# Altium project BW1097_R2M2E3.PrjPcb (part 6 of 10)
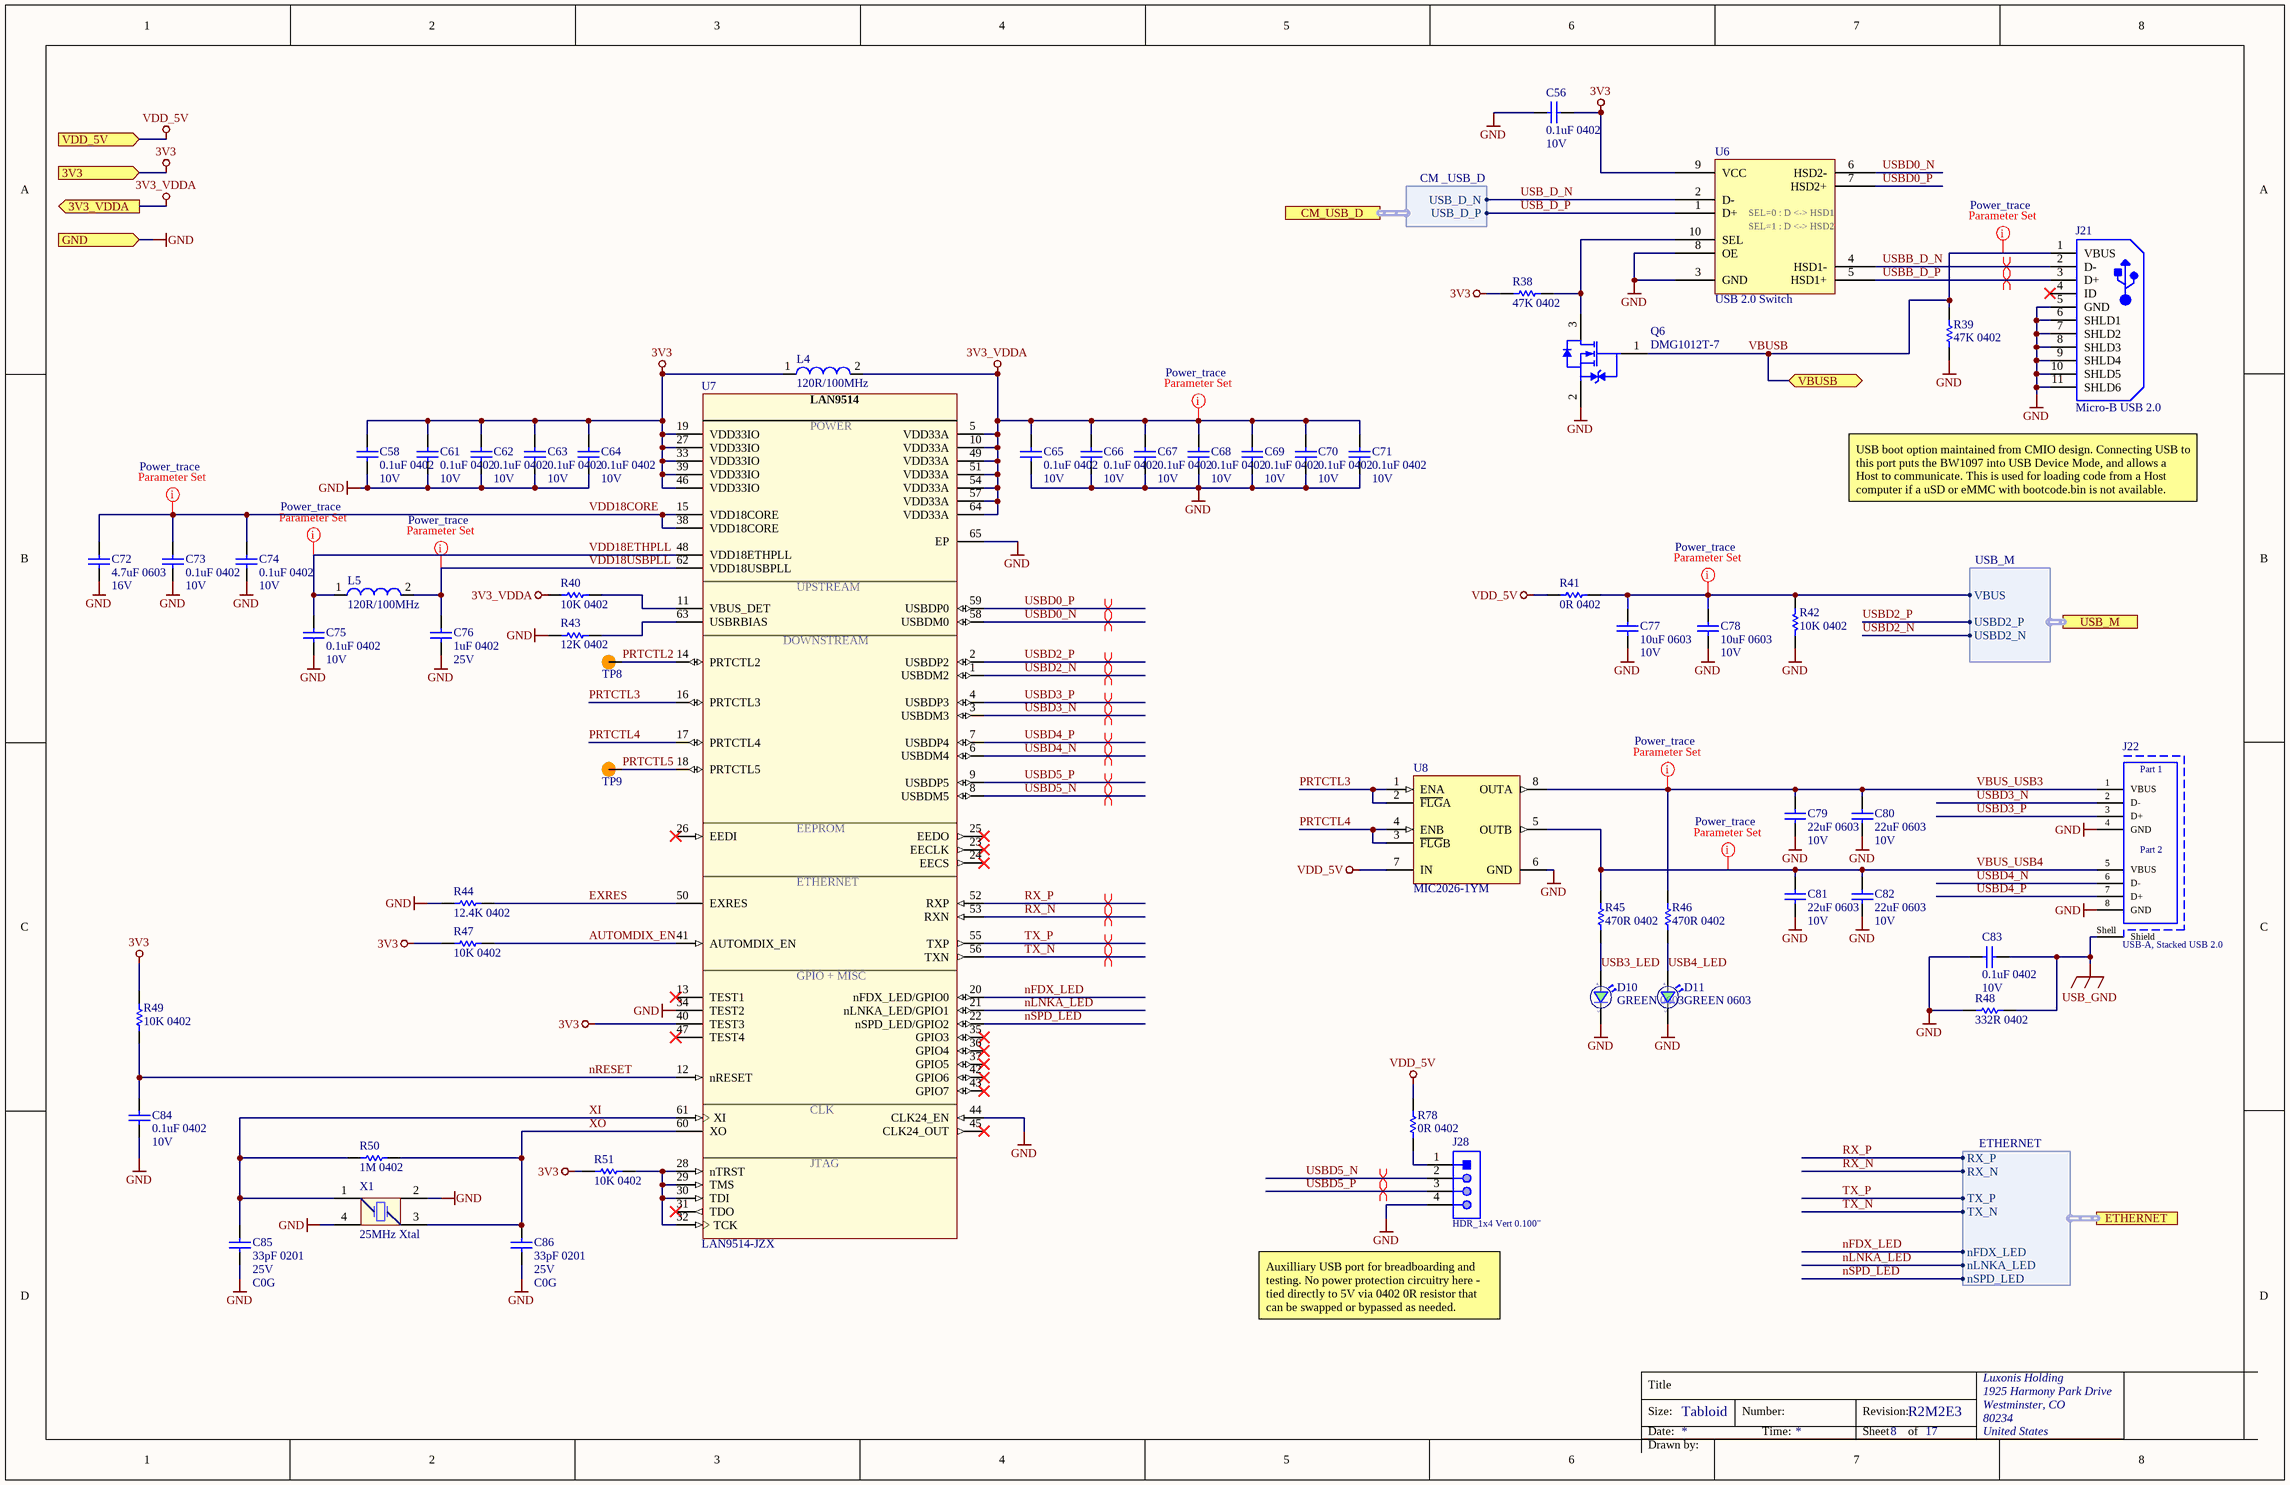
[diagram p114: BW1097_HUB.SchDoc]

## Sheet BW1097_HUB.SchDoc: =project_title (continued)

### Library data of the parts (continued)
X1 = 8Z-25.000MAAJ-T: CRYSTAL 25.0000MHZ 18PF SMD; Manufacturer 1: TXC; Frequency Tolerance: 30ppm; ESR (Equivalent Series Resistance): 100R; Manufacturer Part Number 1: 8Z-25.000MAAJ-T; Supplier 1: Digi-Key; Stock 1: 7343; Pricing 1: 1=1.36000, 10=1.30100, 50=1.27060, 100=1.08900, 500=1.05876, 1000=0.89238 (USD); RoHS: Yes; Mount: Surface Mount; Case/Package: SMD/SMT; Number of Pins: 4; Min Operating Temperature: -10°C; Max Operating Temperature: 70°C; Frequency: 25MHz; Load Capacitance: 18pF; Packaging: Tape and Reel; Package Quantity: 3000; Tolerance: 30ppm; Frequency Stability: 30ppm; Termination: SMD/SMT; Length: 2.5mm; Height: 0.022inch; Width: 2mm; Depth: 2.05mm; REACH SVHC: No SVHC; Lead Free: Lead Free; ComponentLink1URL: https://datasheet.ciiva.com/26833/getdatasheetpartid-743023-26833236.pdf?src-supplier=Verical; ComponentLink1Description: https://datasheet.ciiva.com/26833/getdatasheetpartid-743023-26833236.pdf?src-supplier=Verical; ComponentLink2URL: https://datasheet.ciiva.com/22698/1041872-22698773.pdf?src-supplier=Element14; ComponentLink2Description: https://datasheet.ciiva.com/22698/1041872-22698773.pdf?src-supplier=Element14; ComponentLink3URL: https://datasheet.ciiva.com/1356/number-crystal-basic-1356678.pdf?src-supplier=Element14; ComponentLink3Description: https://datasheet.ciiva.com/1356/number-crystal-basic-1356678.pdf?src-supplier=Element14; ComponentLink4URL: https://datasheet.ciiva.com/859/8z-859017.pdf?src-supplier=Digi-Key; ComponentLink4Description: https://datasheet.ciiva.com/859/8z-859017.pdf?src-supplier=Digi-Key; ComponentLink5URL: https://datasheet.ciiva.com/859/8z-859018.pdf?src-supplier=Digi-Key; ComponentLink5Description: https://datasheet.ciiva.com/859/8z-859018.pdf?src-supplier=Digi-Key; ComponentLink6URL: https://datasheet.ciiva.com/859/8z-859019.pdf?src-supplier=Digi-Key; ComponentLink6Description: https://datasheet.ciiva.com/859/8z-859019.pdf?src-supplier=Digi-Key; Supplier 2: Mouser; Supplier Part Number 1: 887-1145-1-ND; Supplier Part Number 2: 717-8Z-25.000MAAJ-T

## Sheet BW1097_EthernetSchDoc.SchDoc: =project_title
size Tabloid; CompanyName: Luxonis Holding; DrawnBy: Brian Weinstein; Organization: Luxonis Holding; Address1: 1925 Harmony Park Drive; Address2: Westminster, CO; Address3: 80234; Address4: United States; DocumentNumber: D0000196; Revision: R2M2E3; SheetNumber: 16; SheetTotal: 17
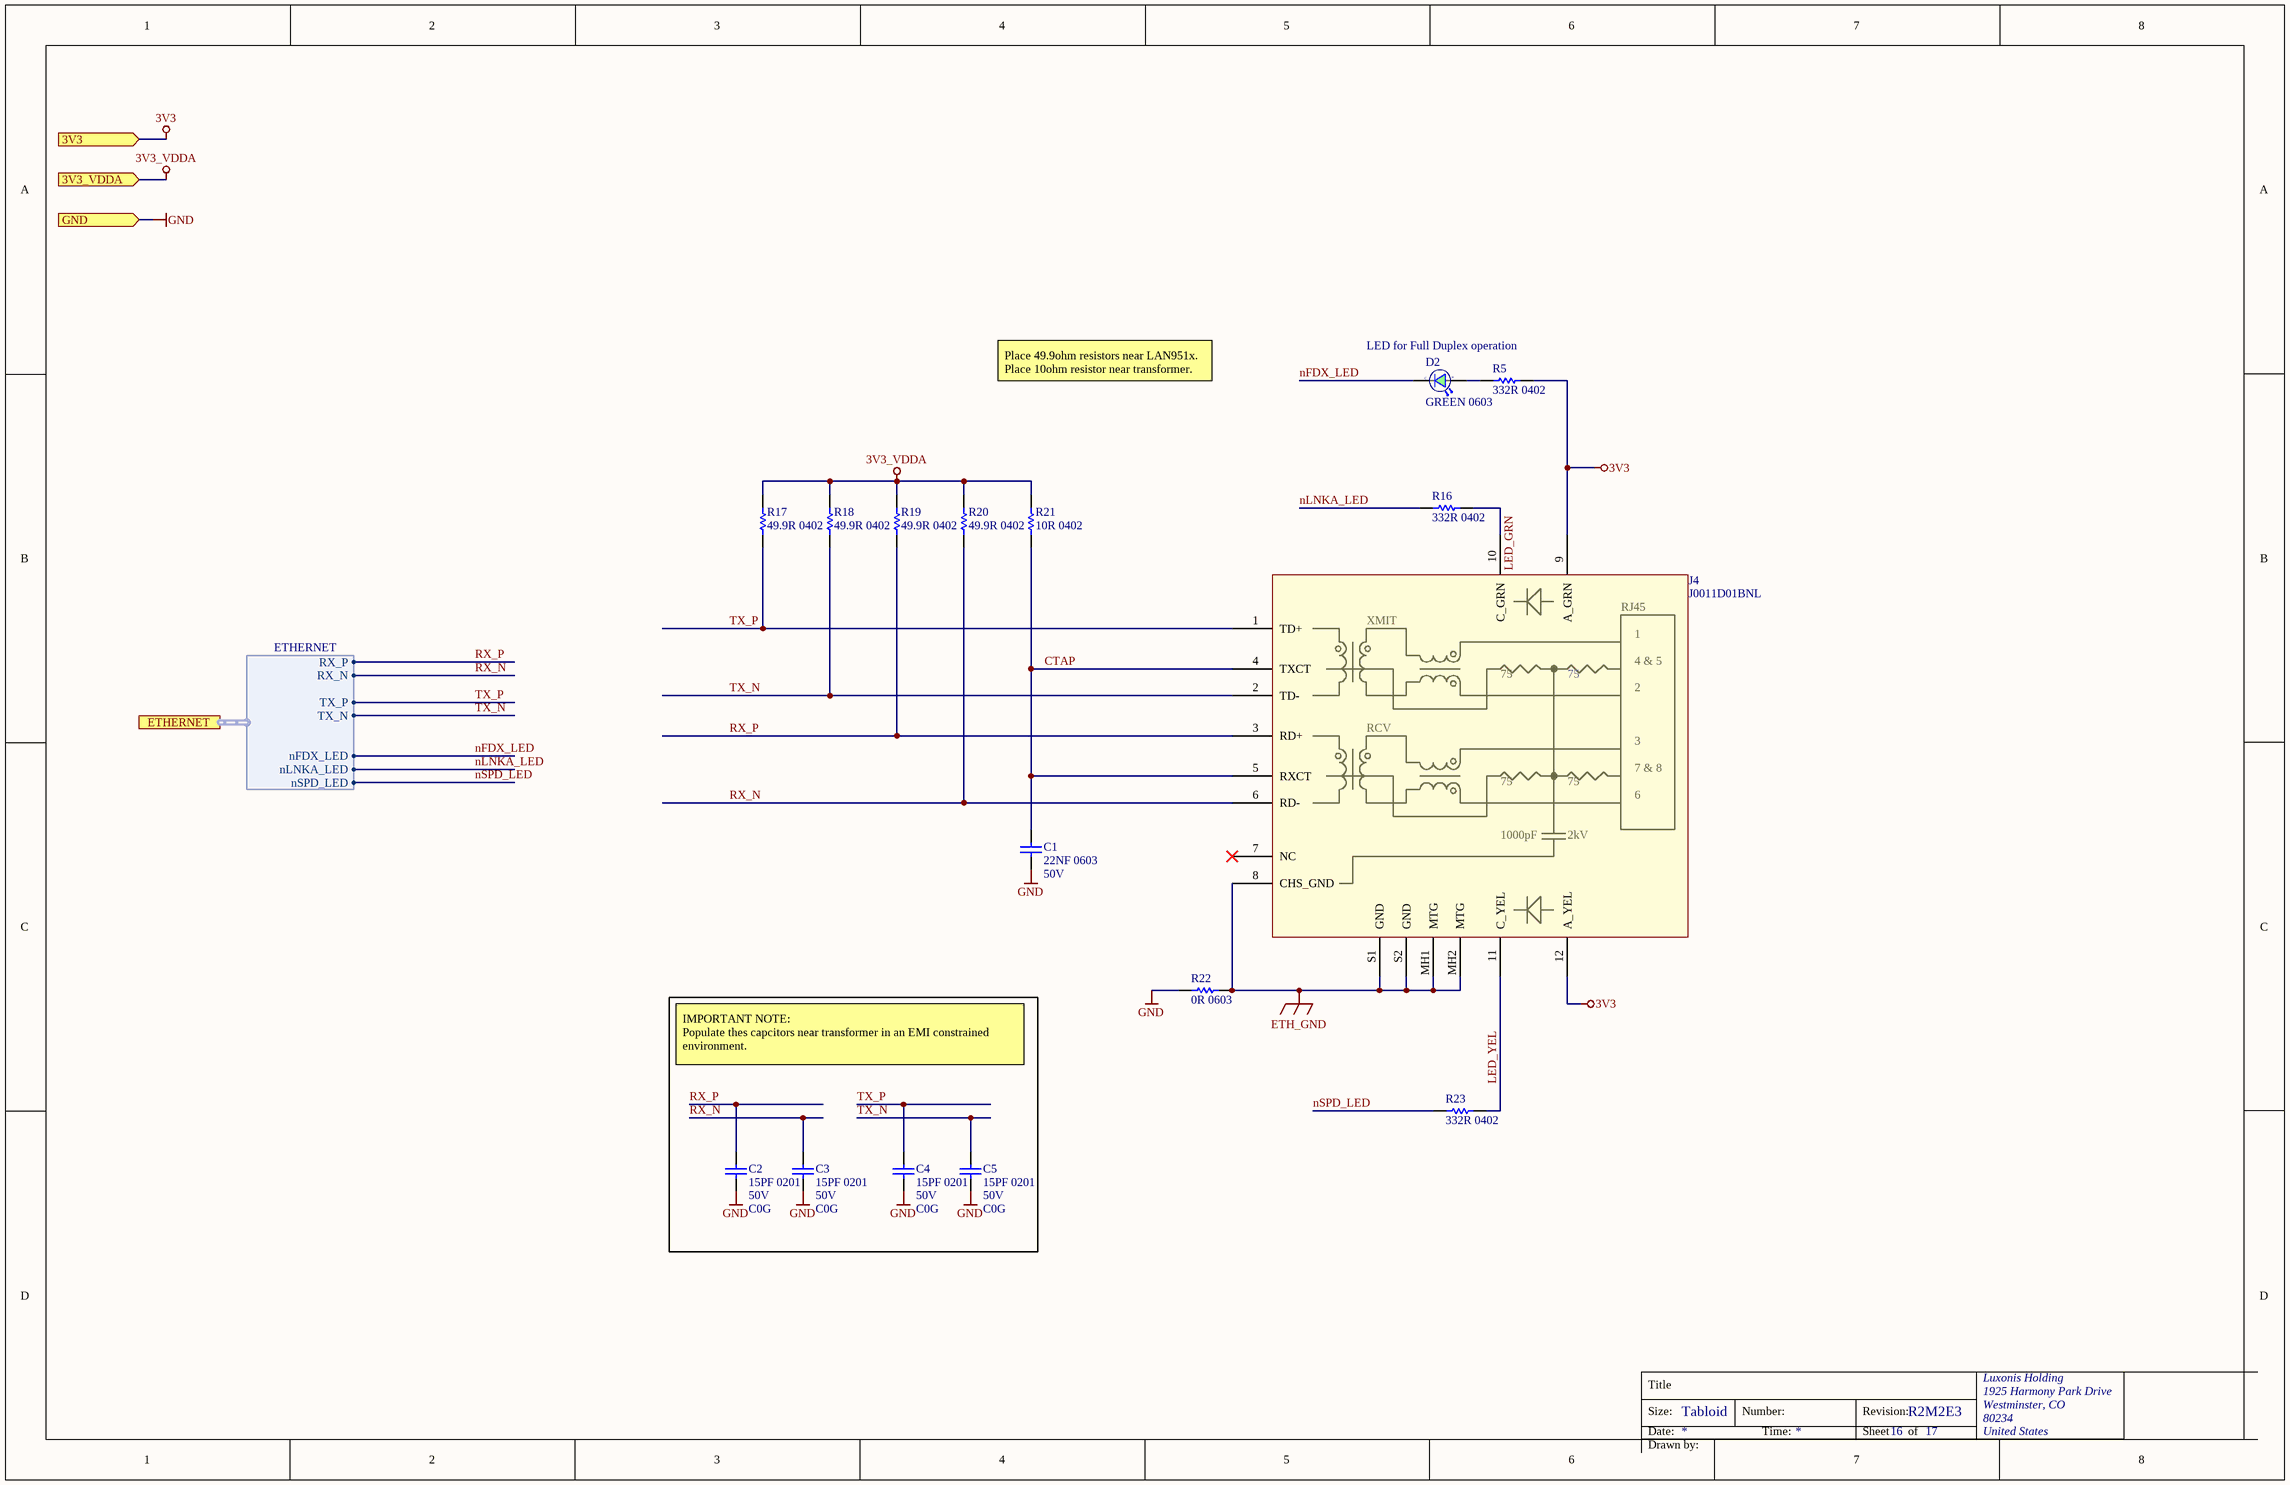
[diagram p7: BW1097_EthernetSchDoc.SchDoc]

### Parts
C1  22NF 0603  Voltage: 50V  [CAPC0603(1608)100_N]
C2  15PF 0201  Voltage: 50V  Dielectric: C0G  [CAPC0201(0603)33_L]
C3  15PF 0201  Voltage: 50V  Dielectric: C0G  [CAPC0201(0603)33_L]
C4  15PF 0201  Voltage: 50V  Dielectric: C0G  [CAPC0201(0603)33_L]
C5  15PF 0201  Voltage: 50V  Dielectric: C0G  [CAPC0201(0603)33_L]
D2  GREEN 0603  [SML_D1xx8W]
J4  J0011D01BNL  [J0011D01BNL]
R5  332R 0402  [RESC0402(1005)_N]
R16  332R 0402  [RESC0402(1005)_N]
R17  49.9R 0402  [RESC0402(1005)_N]
R18  49.9R 0402  [RESC0402(1005)_N]
R19  49.9R 0402  [RESC0402(1005)_N]
R20  49.9R 0402  [RESC0402(1005)_N]
R21  10R 0402  [RESC0402(1005)_N]
R22  0R 0603  [RESC0603(1608)_N]
R23  332R 0402  [RESC0402(1005)_N]

### Ports
3V3 (in), 3V3_VDDA (in), ETHERNET (harness ETHERNET), GND (in)

### Harnesses
ETHERNET: RX_P, RX_N, TX_P, TX_N, nFDX_LED, nLNKA_LED, nSPD_LED

### Nets
3V3: J4.9(A_GRN) J4.12(A_YEL) R5.2 ; port 3V3
3V3_VDDA: R17.2 R18.2 R19.2 R20.2 R21.2 ; port 3V3_VDDA
ETH_GND: J4.8(CHS_GND) J4.MH1(MTG) J4.MH2(MTG) J4.S1(GND) J4.S2(GND) R22.2
GND: C1.1 C2.1 C3.1 C4.1 C5.1 R22.1 ; port GND
CTAP: C1.2 J4.4(TXCT) J4.5(RXCT) R21.1
LED_GRN: J4.10(C_GRN) R16.2
LED_YEL: J4.11(C_YEL) R23.2
nFDX_LED: D2.1(C) ; port ETHERNET.nFDX_LED
nLNKA_LED: R16.1 ; port ETHERNET.nLNKA_LED
nSPD_LED: R23.1 ; port ETHERNET.nSPD_LED
RX_N: C3.2 J4.6(RD-) R20.1 ; port ETHERNET.RX_N
RX_P: C2.2 J4.3(RD+) R19.1 ; port ETHERNET.RX_P
TX_N: C5.2 J4.2(TD-) R18.1 ; port ETHERNET.TX_N
TX_P: C4.2 J4.1(TD+) R17.1 ; port ETHERNET.TX_P
NetD2_2: D2.2(A) R5.1

Not connected (* = marked no-connect by the designer): J4 7(NC)*

### Notes on the sheet
- LED for Full Duplex operation
- Place 49.9ohm resistors near LAN951x.
  Place 10ohm resistor near transformer.
- IMPORTANT NOTE:
  Populate thes capcitors near transformer in an EMI constrained environment.
- Title
- Size:
- Date:
- Tabloid
- Number:
- Time:
- Revision:
- Sheet
- of
- Drawn by:
- (in symbol J0011D01BNL) XMIT; 4 & 5; 75; RCV; 7 & 8; 1000pF; 2kV

### Library data of the parts
C1 = C0603C223K5RACTU: CAP CER 0.022UF 50V X7R 0603; Manufacturer 1: KEMET; Dielectric Material: Ceramic; Tolerance: 10%; Dissipation Factor: 2.5%; Manufacturer Part Number 1: C0603C223K5RACTU; Supplier 1: Digi-Key; Stock 1: 77845; Pricing 1: 1=0.10000, 10=0.06400, 100=0.02850, 500=0.02036, 1000=0.01600 (USD); RoHS: Yes; Mount: Surface Mount,PCB; Case/Package: 0603; Number of Pins: 2; Case Code (Imperial): 0603; Case Code (Metric): 1608; Contact Plating: Tin,Matte; Min Operating Temperature: -55°C; Max Operating Temperature: 125°C; Capacitance: 22nF; Packaging: Tape and Reel; Voltage Rating (DC): 50V; Dielectric: X7R; Package Quantity: 4000; Termination: SMD/SMT; Voltage Rating: 50V; Length: 1.6mm; Height: 0.8mm; Depth: 0.8mm; Width: 0.8mm; Thickness: 0.034inch; Lead Pitch: 0.7mm; Radiation Hardening: No; REACH SVHC: No SVHC; ComponentLink1URL: https://datasheet.ciiva.com/7823/1776091-7823698.pdf?src-supplier=Element14; ComponentLink1Description: https://datasheet.ciiva.com/7823/1776091-7823698.pdf?src-supplier=Element14; ComponentLink2URL: https://datasheet.ciiva.com/7824/kem-c1002-x7r-smd-7824021.pdf?src-supplier=Element14; ComponentLink2Description: https://datasheet.ciiva.com/7824/kem-c1002-x7r-smd-7824021.pdf?src-supplier=Element14; Supplier 2: Mouser; Supplier Part Number 1: 399-1280-6-ND; Supplier Part Number 2: 80-C0603C223K5R
C2-C5 = GRM0335C1H150JA01D: CAP CER 15PF 50V C0G/NP0 0201; Manufacturer 1: Murata; Tolerance: 5%; Manufacturer Part Number 1: GRM0335C1H150JA01D; Supplier 1: Digi-Key; Stock 1: 667552; Pricing 1: 1=0.10000, 10=0.01500, 100=0.00680, 500=0.00484, 1000=0.00380, 2500=0.00345, 5000=0.00317 (USD); RoHS: Yes; Mount: Surface Mount; Case/Package: 0201; Case Code (Metric): 0603; Case Code (Imperial): 0201; Min Operating Temperature: -55°C; Max Operating Temperature: 125°C; Capacitance: 15pF; Packaging: Tape and Reel; Voltage Rating: 50V; Voltage Rating (DC): 50V; Package Quantity: 1; Termination: SMD/SMT; Length: 0.6mm; Height: 0.3mm; Width: 0.012inch; Thickness: 0.013inch; Depth: 0.3mm; Radiation Hardening: No; Lead Free: Lead Free; REACH SVHC: No SVHC; ComponentLink1URL: https://datasheet.ciiva.com/11608/product-11608680.pdf?src-supplier=Avnet; ComponentLink1Description: https://datasheet.ciiva.com/11608/product-11608680.pdf?src-supplier=Avnet; ComponentLink2URL: https://datasheet.ciiva.com/26843/getdatasheetpartid-707838-26843722.pdf?src-supplier=Verical; ComponentLink2Description: https://datasheet.ciiva.com/26843/getdatasheetpartid-707838-26843722.pdf?src-supplier=Verical; ComponentLink3URL: https://datasheet.ciiva.com/14906/partnumbering-e-01-14906504.pdf?src-supplier=Digi-Key; ComponentLink3Description: https://datasheet.ciiva.com/14906/partnumbering-e-01-14906504.pdf?src-supplier=Digi-Key; ComponentLink4URL: https://datasheet.ciiva.com/5445/product-5445691.pdf?src-supplier=Mouser; ComponentLink4Description: https://datasheet.ciiva.com/5445/product-5445691.pdf?src-supplier=Mouser; Supplier 2: Mouser; Supplier Part Number 1: 490-6116-1-ND; Supplier Part Number 2: 81-GRM0335C1H150JA1D
D2 = SML-D12M8WT86: as D10 on sheet BW1097_HUB; Supplier 1: Digi-Key; Manufacturer Part Number: SML-D12M8WT86; Stock 1: 112971; Pricing 1: 1=0.33000, 10=0.23900, 100=0.11340, 500=0.07560, 1000=0.05922 (USD); Mount: Surface Mount; Case/Package: 0603; Number of Pins: 2; Case Code (Metric): 1608; Case Code (Imperial): 0603; Min Operating Temperature: -40°C; Max Operating Temperature: 85°C; Forward Voltage: 2.2V; Packaging: Tape and Reel; Dominant Wavelength: 572nm; Wavelength: 572nm; Illumination Colour: Green; Package Quantity: 1; Test Current: 20mA; Lens Transparency: Diffused; Length: 1.6mm; Height: 0.65mm; Width: 0.8mm; Radiation Hardening: No; REACH SVHC: Unknown; Lead Free: Lead Free; ComponentLink1URL: https://datasheet.ciiva.com/11774/0900766b80df3ada-11774260.pdf; ComponentLink1Description: https://datasheet.ciiva.com/11774/0900766b80df3ada-11774260.pdf; ComponentLink2URL: https://datasheet.ciiva.com/3161/sml-d1-3161419.pdf; ComponentLink2Description: https://datasheet.ciiva.com/3161/sml-d1-3161419.pdf; ComponentLink3URL: https://datasheet.ciiva.com/2110/sml-d1-2110396.pdf; ComponentLink3Description: https://datasheet.ciiva.com/2110/sml-d1-2110396.pdf; ComponentLink4URL: https://datasheet.ciiva.com/2110/sml-d1-2110397.pdf; ComponentLink4Description: https://datasheet.ciiva.com/2110/sml-d1-2110397.pdf; ComponentLink5URL: https://datasheet.ciiva.com/2110/sml-d1-2110398.pdf; ComponentLink5Description: https://datasheet.ciiva.com/2110/sml-d1-2110398.pdf; Manufacturer 1: Rohm; Manufacturer Part Number 1: SML-D12M8WT86; RoHS: Yes; Color: Green,Yellow; Illumination Color: Green; ComponentLink6URL: https://datasheet.ciiva.com/11774/0900766b80df3ada-11774260.pdf?src-supplier=RSComponents; ComponentLink6Description: https://datasheet.ciiva.com/11774/0900766b80df3ada-11774260.pdf?src-supplier=RSComponents; ComponentLink7URL: https://datasheet.ciiva.com/3161/sml-d1-3161419.pdf?src-supplier=Avnet; ComponentLink7Description: https://datasheet.ciiva.com/3161/sml-d1-3161419.pdf?src-supplier=Avnet; ComponentLink8URL: https://datasheet.ciiva.com/2110/sml-d1-2110396.pdf?src-supplier=Digi-Key; ComponentLink8Description: https://datasheet.ciiva.com/2110/sml-d1-2110396.pdf?src-supplier=Digi-Key; ComponentLink9URL: https://datasheet.ciiva.com/2110/sml-d1-2110397.pdf?src-supplier=Digi-Key; ComponentLink9Description: https://datasheet.ciiva.com/2110/sml-d1-2110397.pdf?src-supplier=Digi-Key; ComponentLink10URL: https://datasheet.ciiva.com/2110/sml-d1-2110398.pdf?src-supplier=Digi-Key; ComponentLink10Description: https://datasheet.ciiva.com/2110/sml-d1-2110398.pdf?src-supplier=Digi-Key; Supplier Part Number 1: 511-1578-1-ND
J4 = J0011D01BNL: CONN MAGJACK 1PORT 100 BASE-TX 1 Port RJ45 Magjack Connector Through Hole 10/100 Base-TX, AutoMDIX; Manufacturer 1: Pulse; Number of Contacts: 8; Shielding: Shielded; Gender: Female; Current Rating: 8mA; Number of Ports: 1; Direction: Down; Number of Cores per Jack: 4; Pitch: 2.54mm; Manufacturer Part Number 1: J0011D01BNL; Supplier 1: Digi-Key; Stock 1: 2382; Pricing 1: 1=7.92000, 10=7.59000, 25=6.93000, 50=6.60000, 100=6.27000, 250=5.61000, 500=5.28000, 1000=4.62000 (USD); RoHS: Yes; Mount: Through Hole; Contact Plating: Gold; Contact Material: Bronze; Color: Green,Yellow; Housing Material: Thermoplastic; Min Operating Temperature: 0°C; Max Operating Temperature: 70°C; Termination: Solder; Orientation: Right Angle; Package Quantity: 30; Number of Rows: 1; Packaging: Tray; Connector Type: RJ45; Number of Positions Loaded: 8; Length: 16.26mm; Depth: 21.59mm; Radiation Hardening: No; Lead Free: Lead Free; ComponentLink1URL: https://datasheet.ciiva.com/3138/+j403-3138718.pdf?src-supplier=Avnet; ComponentLink1Description: https://datasheet.ciiva.com/3138/+j403-3138718.pdf?src-supplier=Avnet; ComponentLink2URL: https://datasheet.ciiva.com/16650/+j403-16650550.pdf?src-supplier=Avnet+Europe; ComponentLink2Description: https://datasheet.ciiva.com/16650/+j403-16650550.pdf?src-supplier=Avnet+Europe; Supplier Part Number 1: 553-1483-ND; Supplier 2: Arrow; Supplier 3: Mouser; Supplier 4: TTI; Supplier Part Number 2: J0011D01BNL; Supplier Part Number 3: 673-J0011D01BNL; Supplier Part Number 4: J0011D01BNL
R5 R16 R23 = RC0402FR-07332RL: as R48 on sheet BW1097_HUB; Manufacturer Part Number 1: RC0402FR-07332RL; Supplier 1: Digi-Key; Stock 1: 2789251; Pricing 1: 1=0.10000, 10=0.01600, 100=0.00640, 1000=0.00289, 2500=0.00251, 5000=0.00207 (USD); RoHS: Yes; Case/Package: 0402; Weight: 2.3E-05oz; Case Code (Imperial): 0402; Case Code (Metric): 1005; Min Operating Temperature: -55°C; Max Operating Temperature: 155°C; Packaging: Tape and Reel; Resistance: 332R; Tolerance: 1%; Composition: Thick Film; Voltage Rating (DC): 50V; Termination: SMD/SMT; Military Standard: Not; Length: 1mm; Height: 0.35mm; Width: 0.5mm; Depth: 0.5mm; Lead Free: Lead Free; ComponentLink1URL: https://datasheet.ciiva.com/16929/pyu-rc0402-51-rohs-l-6-r-16929351.pdf?src-supplier=Future+Electronics; ComponentLink1Description: https://datasheet.ciiva.com/16929/pyu-rc0402-51-rohs-l-6-r-16929351.pdf?src-supplier=Future+Electronics; Supplier 2: Mouser; Supplier Part Number 1: 311-332LRCT-ND; Supplier Part Number 2: 603-RC0402FR-07332RL
R17-R20 = RC0402FR-0749R9L: RES SMD 49.9 OHM 1% 1/16W 0402; Manufacturer 1: Yageo; Power Rating: 62.5mW; Temperature Coefficient: 100ppm/°C; Voltage Rating: 50V; Max Power Dissipation: 63mW; Manufacturer Part Number 1: RC0402FR-0749R9L; Supplier 1: Digi-Key; Stock 1: 15110719; Pricing 1: 1=0.10000, 10=0.01600, 100=0.00640, 1000=0.00289, 2500=0.00251, 5000=0.00207 (USD); RoHS: Yes; Case/Package: 0402; Number of Pins: 2; Case Code (Imperial): 0402; Case Code (Metric): 1005; Min Operating Temperature: -55°C; Max Operating Temperature: 155°C; Packaging: Tape and Reel; Resistance: 49.9R; Tolerance: 1%; Composition: Thick Film; Number of Terminations: 2; Package Quantity: 1; Termination: SMD/SMT; Military Standard: Not; Voltage Rating (DC): 50V; Features: Moisture Resistant; Working Voltage: 50V; Length: 1mm; Height: 0.016inch; Width: 0.5mm; Depth: 0.5mm; Lead Free: Lead Free; REACH SVHC: No SVHC; ComponentLink1URL: https://datasheet.ciiva.com/11819/0900766b80c66297-11819508.pdf?src-supplier=RSComponents; ComponentLink1Description: https://datasheet.ciiva.com/11819/0900766b80c66297-11819508.pdf?src-supplier=RSComponents; ComponentLink2URL: https://datasheet.ciiva.com/7983/1018594-7983542.pdf?src-supplier=Element14; ComponentLink2Description: https://datasheet.ciiva.com/7983/1018594-7983542.pdf?src-supplier=Element14; ComponentLink3URL: https://datasheet.ciiva.com/16743/pyu-rc0402-51-rohs-l-6-r-16743942.pdf?src-supplier=Future+Electronics; ComponentLink3Description: https://datasheet.ciiva.com/16743/pyu-rc0402-51-rohs-l-6-r-16743942.pdf?src-supplier=Future+Electronics; ComponentLink4URL: https://datasheet.ciiva.com/22747/1018594-22747514.pdf?src-supplier=Element14; ComponentLink4Description: https://datasheet.ciiva.com/22747/1018594-22747514.pdf?src-supplier=Element14; ComponentLink5URL: https://datasheet.ciiva.com/2453/pyu-r-int-thick-7-2453355.pdf?src-supplier=Digi-Key; ComponentLink5Description: https://datasheet.ciiva.com/2453/pyu-r-int-thick-7-2453355.pdf?src-supplier=Digi-Key; ComponentLink6URL: https://datasheet.ciiva.com/2453/pyu-r-int-thick-7-2453356.pdf?src-supplier=Digi-Key; ComponentLink6Description: https://datasheet.ciiva.com/2453/pyu-r-int-thick-7-2453356.pdf?src-supplier=Digi-Key; ComponentLink7URL: https://datasheet.ciiva.com/2453/pyu-r-int-thick-7-2453357.pdf?src-supplier=Digi-Key; ComponentLink7Description: https://datasheet.ciiva.com/2453/pyu-r-int-thick-7-2453357.pdf?src-supplier=Digi-Key; Supplier 2: Mouser; Supplier Part Number 1: 311-49.9LRCT-ND; Supplier Part Number 2: 603-RC0402FR-0749R9L
R21 = RC0402FR-0710RL: RES SMD 10 OHM 1% 1/16W 0402; Manufacturer 1: Yageo; Power Rating: 63mW; Voltage Rating: 50V; Temperature Coefficient: 100ppm/°C; Manufacturer Part Number 1: RC0402FR-0710RL; Supplier 1: Digi-Key; Stock 1: 9523799; Pricing 1: 1=0.10000, 10=0.02400, 100=0.00970, 1000=0.00435, 2500=0.00377, 5000=0.00312 (USD); RoHS: Yes; Case/Package: 0402; Case Code (Imperial): 0402; Case Code (Metric): 1005; Min Operating Temperature: -55°C; Max Operating Temperature: 155°C; Tolerance: 1%; Resistance: 10R; Packaging: Tape and Reel; Termination: SMD/SMT; Composition: Thick Film; Military Standard: Not; Number of Terminations: 2; Working Voltage: 50V; Length: 1mm; Height: 0.32mm; Depth: 0.5mm; REACH SVHC: Unknown; Lead Free: Lead Free; ComponentLink1URL: https://datasheet.ciiva.com/11808/0900766b80c66297-11808764.pdf?src-supplier=RSComponents; ComponentLink1Description: https://datasheet.ciiva.com/11808/0900766b80c66297-11808764.pdf?src-supplier=RSComponents; ComponentLink2URL: https://datasheet.ciiva.com/7849/1018594-7849818.pdf?src-supplier=Element14; ComponentLink2Description: https://datasheet.ciiva.com/7849/1018594-7849818.pdf?src-supplier=Element14; ComponentLink3URL: https://datasheet.ciiva.com/46394/1018594-46394954.pdf?src-supplier=Element14; ComponentLink3Description: https://datasheet.ciiva.com/46394/1018594-46394954.pdf?src-supplier=Element14; ComponentLink4URL: https://datasheet.ciiva.com/7849/1018594-7849819.pdf?src-supplier=Element14; ComponentLink4Description: https://datasheet.ciiva.com/7849/1018594-7849819.pdf?src-supplier=Element14; ComponentLink5URL: https://datasheet.ciiva.com/15189/getdatasheetpartid-323697-15189339.pdf?src-supplier=Verical; ComponentLink5Description: https://datasheet.ciiva.com/15189/getdatasheetpartid-323697-15189339.pdf?src-supplier=Verical; Supplier 2: Mouser; Supplier Part Number 1: 311-10.0LRCT-ND; Supplier Part Number 2: 603-RC0402FR-0710RL
R22 = CRCW06030000Z0EA: RES SMD 0 OHM JUMPER 1/10W 0603 0 Ohms Jumper 0.1W, 1/10W Chip Resistor 0603 (1608 Metric) Automotive AEC-Q200 Thick Film; Manufacturer 1: Vishay; Manufacturer Part Number 1: CRCW0603-0000Z0EA; Resistance: 0mR; Power Rating: 100mW; Voltage Rating: 75V; Temperature Coefficient: 100ppm/°C; Tolerance: 5%; Current Rating: 2A; Supplier 1: Digi-Key; Stock 1: 742743; Pricing 1: 1=0.100000, 10=0.034000, 25=0.024400, 50=0.018600, 100=0.013800, 250=0.010480, 500=0.008400, 1000=0.006180 (USD); RoHS: Yes; Mount: Surface Mount; Case/Package: 0603; Weight: 7.1E-05oz; Contact Plating: Tin,Lead; Case Code (Metric): 1608; Case Code (Imperial): 0603; Min Operating Temperature: -55°C; Max Operating Temperature: 155°C; Composition: Thick Film; Termination: SMD/SMT; Packaging: Tape and Reel; Package Quantity: 1; Number of Terminations: 2; Military Standard: Not; Max Power Dissipation: 100mW; Voltage Rating (DC): 75V; Features: Automotive AEC-Q200; Working Voltage: 75V; Length: 1.55mm; Height: 0.02inch; Width: 0.033inch; Depth: 0.85mm; Radiation Hardening: No; Lead Free: Lead Free; REACH SVHC: Unknown; ComponentLink1URL: https://datasheet.ciiva.com/2461/dcrcwe3-2461968.pdf?src-supplier=Digi-Key; ComponentLink1Description: https://datasheet.ciiva.com/2461/dcrcwe3-2461968.pdf?src-supplier=Digi-Key; ComponentLink2URL: https://datasheet.ciiva.com/2461/dcrcwe3-2461969.pdf?src-supplier=Digi-Key; ComponentLink2Description: https://datasheet.ciiva.com/2461/dcrcwe3-2461969.pdf?src-supplier=Digi-Key; ComponentLink3URL: https://datasheet.ciiva.com/2461/dcrcwe3-2461970.pdf?src-supplier=Digi-Key; ComponentLink3Description: https://datasheet.ciiva.com/2461/dcrcwe3-2461970.pdf?src-supplier=Digi-Key; ComponentLink4URL: https://datasheet.ciiva.com/8340/dcrcwe3-8340197.pdf?src-supplier=Avnet; ComponentLink4Description: https://datasheet.ciiva.com/8340/dcrcwe3-8340197.pdf?src-supplier=Avnet; ComponentLink5URL: https://datasheet.ciiva.com/16941/dcrcw-16941302.pdf?src-supplier=Avnet+Europe; ComponentLink5Description: https://datasheet.ciiva.com/16941/dcrcw-16941302.pdf?src-supplier=Avnet+Europe; ComponentLink6URL: https://datasheet.ciiva.com/16199/dcrcwe3-16199063.pdf?src-supplier=Future+Electronics; ComponentLink6Description: https://datasheet.ciiva.com/16199/dcrcwe3-16199063.pdf?src-supplier=Future+Electronics; ComponentLink7URL: https://datasheet.ciiva.com/16725/70201119-16725175.pdf?src-supplier=Allied+Electronics; ComponentLink7Description: https://datasheet.ciiva.com/16725/70201119-16725175.pdf?src-supplier=Allied+Electronics; ComponentLink8URL: https://datasheet.ciiva.com/26316/fld-crcw-e3-data-en-26316615.pdf?src-supplier=Distrelec; ComponentLink8Description: https://datasheet.ciiva.com/26316/fld-crcw-e3-data-en-26316615.pdf?src-supplier=Distrelec; ComponentLink9URL: https://datasheet.ciiva.com/5544/dcrcwe3-109170-5544344.pdf?src-supplier=Mouser; ComponentLink9Description: https://datasheet.ciiva.com/5544/dcrcwe3-109170-5544344.pdf?src-supplier=Mouser; ComponentLink10URL: https://datasheet.ciiva.com/7841/1720486-7841816.pdf?src-supplier=Element14; ComponentLink10Description: https://datasheet.ciiva.com/7841/1720486-7841816.pdf?src-supplier=Element14; ComponentLink11URL: https://datasheet.ciiva.com/7841/1720486-7841817.pdf?src-supplier=Element14; ComponentLink11Description: https://datasheet.ciiva.com/7841/1720486-7841817.pdf?src-supplier=Element14; ComponentLink12URL: https://datasheet.ciiva.com/7841/125364-7841818.pdf?src-supplier=Element14; ComponentLink12Description: https://datasheet.ciiva.com/7841/125364-7841818.pdf?src-supplier=Element14; ComponentLink13URL: https://datasheet.ciiva.com/16721/70201119-16721450.pdf?src-supplier=Allied+Electronics; ComponentLink13Description: https://datasheet.ciiva.com/16721/70201119-16721450.pdf?src-supplier=Allied+Electronics; Supplier Part Number 1: 541-0.0GCT-ND

## Sheet BW1097_MIPI_IO.SchDoc: =project_title
size Tabloid; CompanyName: Luxonis Holding; DrawnBy: Brian Weinstein; Organization: Luxonis Holding; Address1: 1925 Harmony Park Drive; Address2: Westminster, CO; Address3: 80234; Address4: United States; DocumentNumber: D0000196; Revision: R2M2E3; SheetNumber: 13; SheetTotal: 17
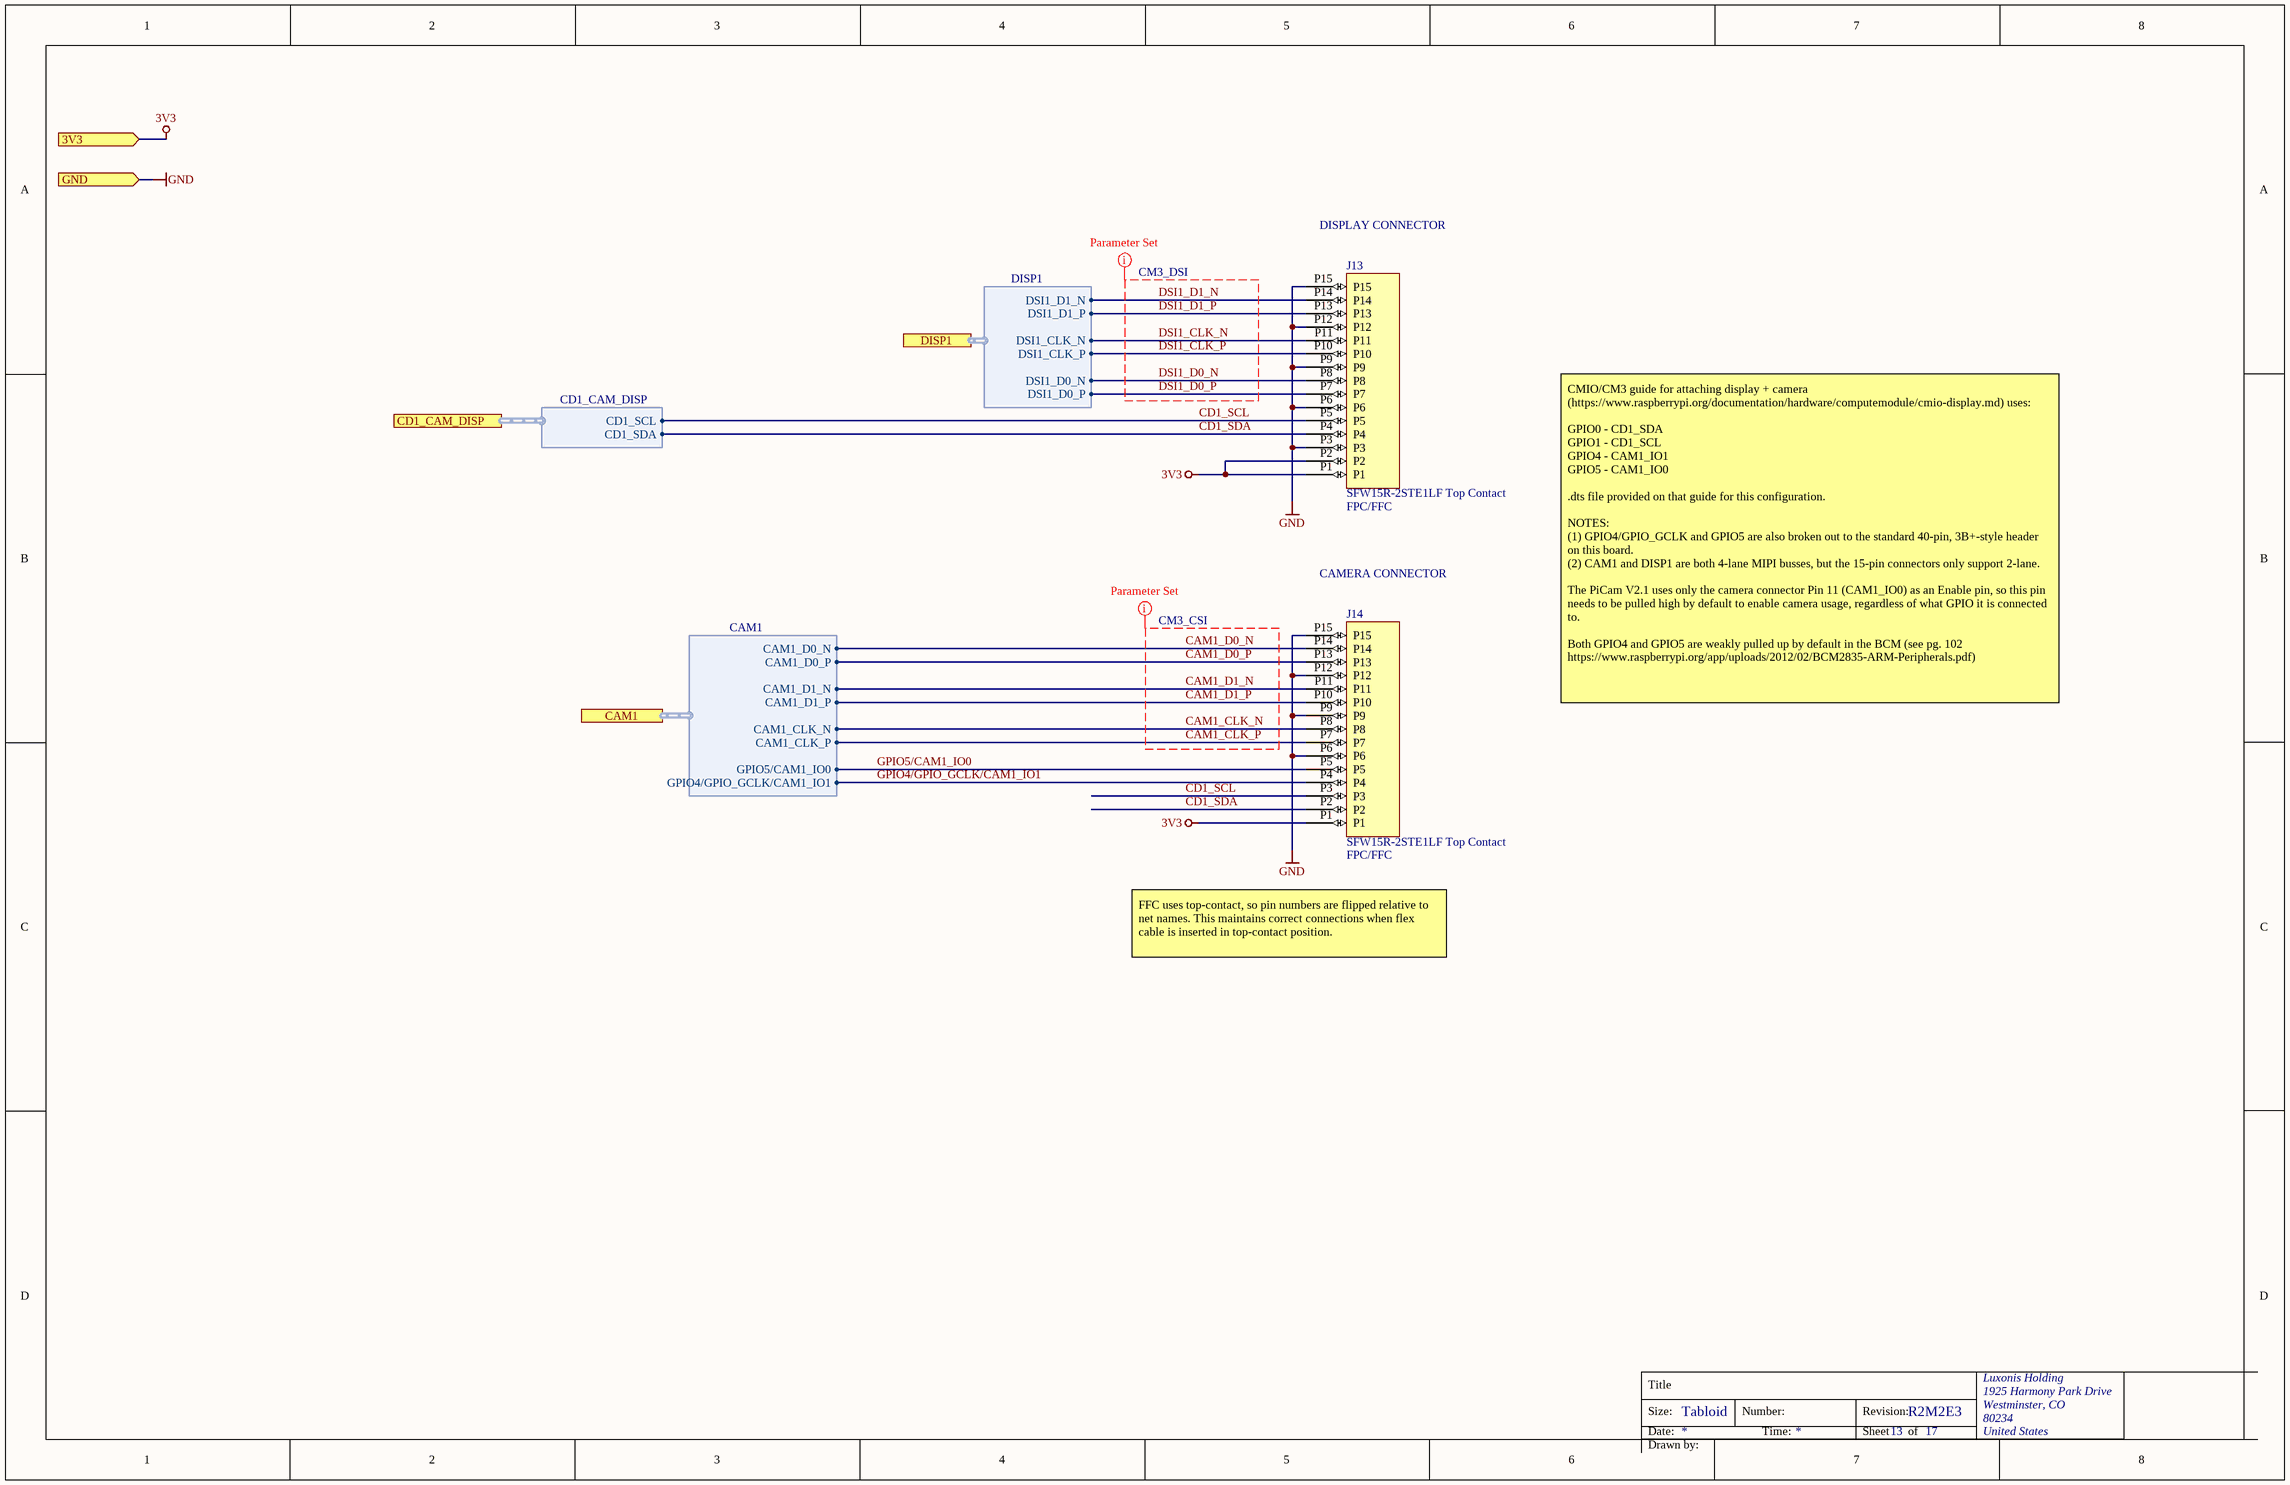
[diagram p8: BW1097_MIPI_IO.SchDoc]

### Parts
J13  SFW15R-2STE1LF Top Contact  Component Subtype: FPC/FFC  [SFW15R-2STE1LF]
J14  SFW15R-2STE1LF Top Contact  Component Subtype: FPC/FFC  [SFW15R-2STE1LF]

### Ports
3V3 (in), CAM1 (harness CAM1), CD1_CAM_DISP (harness CD1_CAM_DISP), DISP1 (harness DISP1), GND (in)

### Harnesses
CD1_CAM_DISP: CD1_SCL, CD1_SDA
CAM1: CAM1_D0_N, CAM1_D0_P, CAM1_D1_N, CAM1_D1_P, CAM1_CLK_N, CAM1_CLK_P, GPIO4/GPIO_GCLK/CAM1_IO1, GPIO5/CAM1_IO0
DISP1: DSI1_D1_N, DSI1_D1_P, DSI1_CLK_N, DSI1_CLK_P, DSI1_D0_N, DSI1_D0_P

### Nets
3V3: J13.P1 J13.P2 J14.P1 ; port 3V3
GND: J13.P3 J13.P6 J13.P9 J13.P12 J13.P15 J14.P6 J14.P9 J14.P12 J14.P15 ; port GND
CAM1_CLK_N: J14.P8 ; port CAM1.CAM1_CLK_N
CAM1_CLK_P: J14.P7 ; port CAM1.CAM1_CLK_P
CAM1_D0_N: J14.P14 ; port CAM1.CAM1_D0_N
CAM1_D0_P: J14.P13 ; port CAM1.CAM1_D0_P
CAM1_D1_N: J14.P11 ; port CAM1.CAM1_D1_N
CAM1_D1_P: J14.P10 ; port CAM1.CAM1_D1_P
CD1_SCL: J13.P5 J14.P3 ; port CD1_CAM_DISP.CD1_SCL
CD1_SDA: J13.P4 J14.P2 ; port CD1_CAM_DISP.CD1_SDA
DSI1_CLK_N: J13.P11 ; port DISP1.DSI1_CLK_N
DSI1_CLK_P: J13.P10 ; port DISP1.DSI1_CLK_P
DSI1_D0_N: J13.P8 ; port DISP1.DSI1_D0_N
DSI1_D0_P: J13.P7 ; port DISP1.DSI1_D0_P
DSI1_D1_N: J13.P14 ; port DISP1.DSI1_D1_N
DSI1_D1_P: J13.P13 ; port DISP1.DSI1_D1_P
GPIO4/GPIO_GCLK/CAM1_IO1: J14.P4 ; port CAM1.GPIO4/GPIO_GCLK/CAM1_IO1
GPIO5/CAM1_IO0: J14.P5 ; port CAM1.GPIO5/CAM1_IO0

### Layout directives
net class CM3_DSI; rule Matched Net Lengths [Tolerance = 5mil]: DSI1_CLK_N, DSI1_CLK_P, DSI1_D0_N, DSI1_D0_P, DSI1_D1_N, DSI1_D1_P
net class CM3_CSI; rule Matched Net Lengths [Tolerance = 5mil]: CAM1_CLK_N, CAM1_CLK_P, CAM1_D0_N, CAM1_D0_P, CAM1_D1_N, CAM1_D1_P

### Notes on the sheet
- DISPLAY CONNECTOR
- CAMERA CONNECTOR
- CMIO/CM3 guide for attaching display + camera (https://www.raspberrypi.org/documentation/hardware/computemodule/cmio-display.md) uses:
  GPIO0 - CD1_SDA
  GPIO1 - CD1_SCL
  GPIO4 - CAM1_IO1
  GPIO5 - CAM1_IO0
  .dts file provided on that guide for this configuration.
  NOTES:
  (1) GPIO4/GPIO_GCLK and GPIO5 are also broken out to the standard 40-pin, 3B+-style header on this board.
  (2) CAM1 and DISP1 are both 4-lane MIPI busses, but the 15-pin connectors only support 2-lane.
  The PiCam V2.1 uses only the camera connector Pin 11 (CAM1_IO0) as an Enable pin, so this pin needs to be pulled high by default to enable camera usage, regardless of what GPIO it is connected to.
  Both GPIO4 and GPIO5 are weakly pulled up by default in the BCM (see pg. 102 https://www.raspberrypi.org/app/uploads/2012/02/BCM2835-ARM-Peripherals.pdf)
- FFC uses top-contact, so pin numbers are flipped relative to net names. This maintains correct connections when flex cable is inserted in top-contact position.
- Title
- Size:
- Date:
- Tabloid
- Number:
- Time:
- Revision:
- Sheet
- of
- Drawn by:

### Library data of the parts
J13 J14 = SFW15R-2STE1LF: CONN FFC FPC TOP 15POS 1MM R/A; Manufacturer: Amphenol; Manufacturer 1: Amphenol FCI; Actuator Material: Glass; Current Rating: 1A; Voltage Rating: 100V; Contact Resistance: 30mR; Number of Positions: 15; Insulation Resistance: 500MR; Wire/Cable Type: Straight; Component Type: Connector; Mount: SMT; Manufacturer PN: SFW15R-2STE1LF; Supplier 1: Digi-Key; Manufacturer Part Number 1: SFW15R-2STE1LF; Stock 1: 4348; Pricing 1: 1=0.51000, 10=0.48200, 25=0.43400, 50=0.38580, 100=0.36960, 250=0.33748, 500=0.32142, 1000=0.26517 (USD); Contact Material: Bronze; Contact Plating: Tin; Housing Color: Brown; Housing Material: Polyphenylene; Min Operating Temperature: -55°C; Max Operating Temperature: 105°C; Packaging: Tape and Reel; Number of Rows: 1; Package Quantity: 2000; Voltage Rating (AC): 100V; Termination: Solder; Contact Location: Top; Number of Contacts: 15; Max Voltage Rating (AC): 100V; Orientation: Right Angle; Length: 20.8mm; Pitch: 1mm; Depth: 6mm; Width: 5.5mm; Lead Free: Lead Free; Flammability Rating: UL94 V-0; ComponentLink1URL: https://datasheet.ciiva.com/670/sfw12lf-670088.pdf?src-supplier=Digi-Key; ComponentLink1Description: https://datasheet.ciiva.com/670/sfw12lf-670088.pdf?src-supplier=Digi-Key; ComponentLink2URL: https://datasheet.ciiva.com/670/sfw12lf-670089.pdf?src-supplier=Digi-Key; ComponentLink2Description: https://datasheet.ciiva.com/670/sfw12lf-670089.pdf?src-supplier=Digi-Key; ComponentLink3URL: https://datasheet.ciiva.com/670/sfw12lf-670090.pdf?src-supplier=Digi-Key; ComponentLink3Description: https://datasheet.ciiva.com/670/sfw12lf-670090.pdf?src-supplier=Digi-Key; ComponentLink4URL: https://datasheet.ciiva.com/5138/sfw12lf-5138988.pdf?src-supplier=Mouser; ComponentLink4Description: https://datasheet.ciiva.com/5138/sfw12lf-5138988.pdf?src-supplier=Mouser; ComponentLink5URL: http://datasheet.octopart.com/SFW15R-2STE1LF-Areva-datasheet-119238.pdf?src-supplier=Mouser; ComponentLink5Description: http://datasheet.octopart.com/SFW15R-2STE1LF-Areva-datasheet-119238.pdf?src-supplier=Mouser; ComponentLink6URL: http://datasheet.octopart.com/SFW15R-2STE1LF-Areva-datasheet-8760026.pdf?src-supplier=_legacy+Avnet; ComponentLink6Description: http://datasheet.octopart.com/SFW15R-2STE1LF-Areva-datasheet-8760026.pdf?src-supplier=_legacy+Avnet; ComponentLink7URL: http://datasheet.octopart.com/SFW15R-2STE1LF-Amphenol-datasheet-94059633.pdf?src-supplier=Newark; ComponentLink7Description: http://datasheet.octopart.com/SFW15R-2STE1LF-Amphenol-datasheet-94059633.pdf?src-supplier=Newark; ComponentLink8URL: http://datasheet.octopart.com/SFW15R-2STE1LF-Amphenol-ICC-datasheet-94059633.pdf?src-supplier=Farnell; ComponentLink8Description: http://datasheet.octopart.com/SFW15R-2STE1LF-Amphenol-ICC-datasheet-94059633.pdf?src-supplier=Farnell; ComponentLink9URL: http://datasheet.octopart.com/SFW15R-2STE1LF-Amphenol-ICC-datasheet-8760026.pdf?src-supplier=Future+Electronics; ComponentLink9Description: http://datasheet.octopart.com/SFW15R-2STE1LF-Amphenol-ICC-datasheet-8760026.pdf?src-supplier=Future+Electronics; Supplier Part Number 1: 609-1906-1-ND; RoHS: Yes; Supplier 2: Digi-Key; Manufacturer 2: Amphenol FCI; Manufacturer Part Number 2: SFW15R-2STE1LF; Stock 2: 4348; Pricing 2: 1=0.51000, 10=0.48200, 25=0.43400, 50=0.38580, 100=0.36960, 250=0.33748, 500=0.32142, 1000=0.26517 (USD); Supplier 3: Mouser; Manufacturer 3: Amphenol FCI; Manufacturer Part Number 3: SFW15R-2STE1LF; Stock 3: 4218; Pricing 3: 1=0.46000, 10=0.35000, 100=0.33600, 500=0.29200, 1000=0.24100, 2000=0.21900, 4000=0.21100, 10000=0.19700, 24000=0.19400 (USD); Supplier Part Number 2: 609-1906-6-ND; Supplier Part Number 3: 649-SFW15R-2STE1LF

## Sheet BW1097_AV.SchDoc: =project_title
size Tabloid; CompanyName: Luxonis Holding; DrawnBy: Brian Weinstein; Organization: Luxonis Holding; Address1: 1925 Harmony Park Drive; Address2: Westminster, CO; Address3: 80234; Address4: United States; DocumentNumber: D0000196; Revision: R2M2E3; SheetNumber: 17; SheetTotal: 17
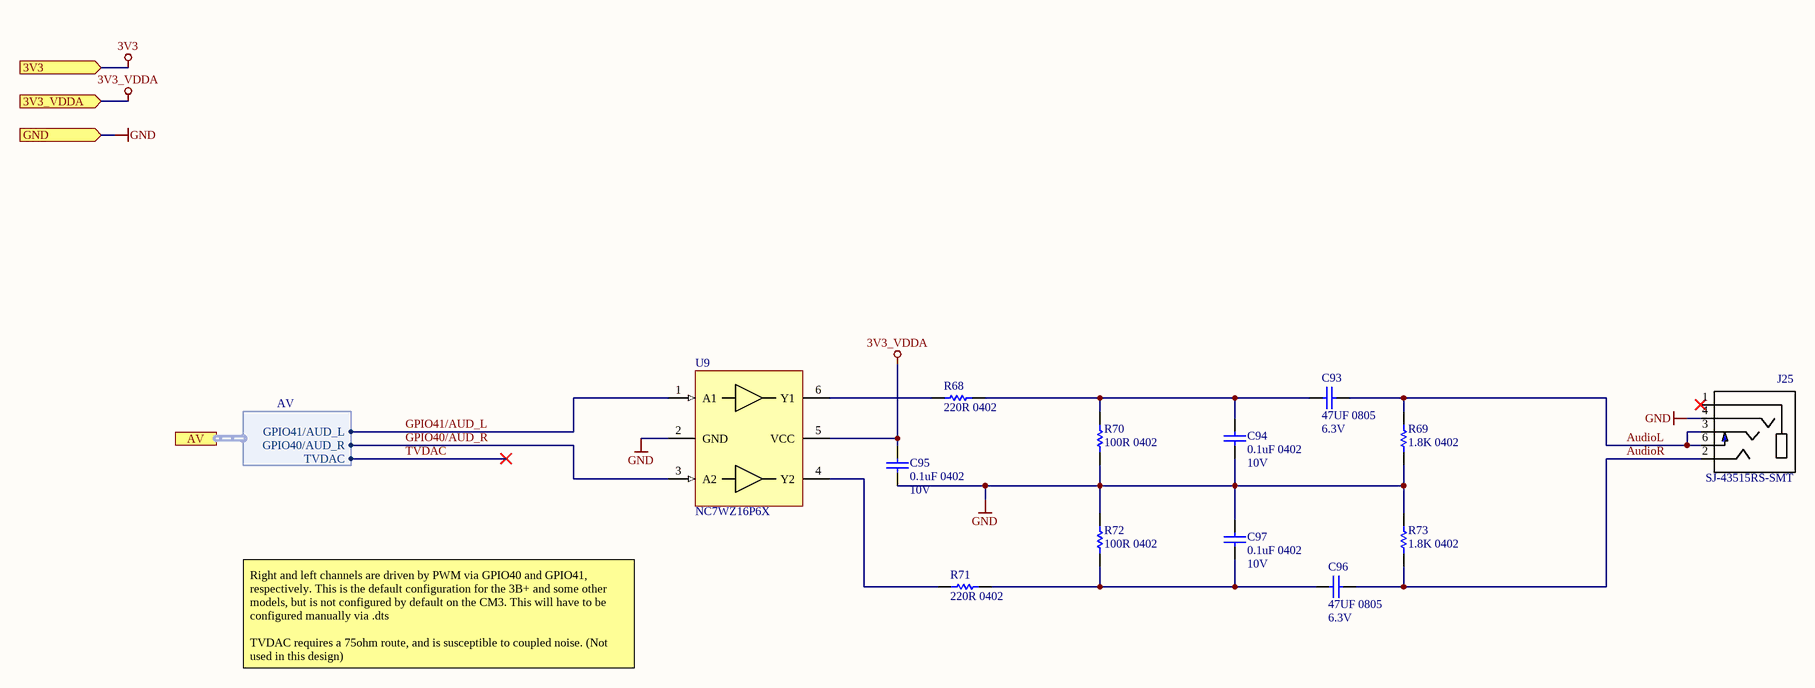
[diagram p9: BW1097_AV.SchDoc]

### Parts
C93  47UF 0805  Voltage: 6.3V  [CAPC0805(2012)145_N]
C94  0.1uF 0402  Voltage Rating: 10V  [CAPC0402(1005)70_N]
C95  0.1uF 0402  Voltage Rating: 10V  [CAPC0402(1005)70_N]
C96  47UF 0805  Voltage: 6.3V  [CAPC0805(2012)145_N]
C97  0.1uF 0402  Voltage Rating: 10V  [CAPC0402(1005)70_N]
J25  SJ-43515RS-SMT  [SJ-43515RS-SMT]
R68  220R 0402  [RESC0402(1005)_N]
R69  1.8K 0402  [RESC0402(1005)_N]
R70  100R 0402  [RESC0402(1005)_N]
R71  220R 0402  [RESC0402(1005)_N]
R72  100R 0402  [RESC0402(1005)_N]
R73  1.8K 0402  [RESC0402(1005)_N]
U9  NC7WZ16P6X  [NC7WZ16P6X]

### Ports
3V3 (in), 3V3_VDDA (in), AV (harness AV), GND (in)

### Harnesses
AV: GPIO40/AUD_R, GPIO41/AUD_L, TVDAC

### Nets
3V3_VDDA: C95.2 U9.5(VCC) ; port 3V3_VDDA
GND: C94.1 C95.1 C97.1 J25.4(RING2) R69.1 R70.1 R72.1 R73.1 U9.2(GND) ; port GND
AudioL: C93.1 J25.3(RING1) J25.6(RING_SWITCH) R69.2
AudioR: C96.1 J25.2(TIP) R73.2
GPIO40/AUD_R: U9.3(A2) ; port AV.GPIO40/AUD_R
GPIO41/AUD_L: U9.1(A1) ; port AV.GPIO41/AUD_L
NetC93_2: C93.2 C94.2 R68.2 R70.2
NetC96_2: C96.2 C97.2 R71.2 R72.2
NetR68_1: R68.1 U9.6(Y1)
NetR71_1: R71.1 U9.4(Y2)

Not connected (* = marked no-connect by the designer): J25 1(SLEEVE)*

### Notes on the sheet
- Right and left channels are driven by PWM via GPIO40 and GPIO41, respectively. This is the default configuration for the 3B+ and some other models, but is not configured by default on the CM3. This will have to be configured manually via .dts
  TVDAC requires a 75ohm route, and is susceptible to coupled noise. (Not used in this design)
- Title
- Size:
- Date:
- Tabloid
- Number:
- Time:
- Revision:
- Sheet
- of
- Drawn by:

### Library data of the parts
C93 C96 = GRM21BR60J476ME15L: CAP CER 47UF 6.3V X5R 0805; Manufacturer 1: Murata; Tolerance: 20%; Manufacturer Part Number 1: GRM21BR60J476ME15L; Supplier 1: Digi-Key; Stock 1: 16165; Pricing 1: 1=0.48000, 10=0.33900, 100=0.22360, 500=0.16560, 1000=0.14076 (USD); RoHS: Yes; Mount: Surface Mount; Case/Package: 0805; Weight: 0.000335oz; Case Code (Metric): 2012; Case Code (Imperial): 0805; Min Operating Temperature: -55°C; Max Operating Temperature: 85°C; Voltage Rating: 6.3V; Packaging: Tape and Reel; Capacitance: 47uF; Voltage Rating (DC): 6.3V; Package Quantity: 3000; Termination: SMD/SMT; Dielectric: X5R; Length: 2mm; Height: 1.25mm; Width: 0.049inch; Depth: 1.25mm; Thickness: 0.057inch; Lead Free: Lead Free; REACH SVHC: No SVHC; ComponentLink1URL: https://datasheet.ciiva.com/46444/1754700-46444997.pdf?src-supplier=Element14; ComponentLink1Description: https://datasheet.ciiva.com/46444/1754700-46444997.pdf?src-supplier=Element14; Supplier 2: Newark; Supplier 3: Mouser; Supplier Part Number 1: 490-9960-1-ND; Supplier Part Number 2: 40X5890; Supplier Part Number 3: 81-GRM21BR60J476ME5L
C94 C95 C97 = GRM155R71A104JA01D: as C56 on sheet BW1097_HUB; Manufacturer Part Number 1: GRM155R71A104JA01D; Supplier 1: Digi-Key; Stock 1: 1346709; Pricing 1: 1=0.10000, 10=0.02500, 100=0.01130, 500=0.00806, 1000=0.00633, 2500=0.00575, 5000=0.00529 (USD); RoHS: Yes; Mount: Surface Mount; Case/Package: 0402; Case Code (Imperial): 0402; Case Code (Metric): 1005; Min Operating Temperature: -55°C; Max Operating Temperature: 125°C; Tolerance: 5%; Packaging: Tape and Reel; Voltage Rating (DC): 10V; Dielectric: X7R; Package Quantity: 10000; Termination: SMD/SMT; Length: 1mm; Height: 0.5mm; Width: 0.02inch; Thickness: 0.022inch; Depth: 0.5mm; Radiation Hardening: No; Lead Free: Lead Free; ComponentLink1URL: https://datasheet.ciiva.com/5411/product-5411135.pdf?src-supplier=Mouser; ComponentLink1Description: https://datasheet.ciiva.com/5411/product-5411135.pdf?src-supplier=Mouser; ComponentLink2URL: https://datasheet.ciiva.com/11618/c02e-11618821.pdf?src-supplier=Avnet; ComponentLink2Description: https://datasheet.ciiva.com/11618/c02e-11618821.pdf?src-supplier=Avnet; Supplier Part Number 1: 490-10777-1-ND
J25 = SJ-43515RS-SMT: CONN JACK 4COND 3.5MM SMD R/A; Manufacturer 1: CUI; Manufacturer Part Number 1: SJ-43515RS-SMT-TR; Gender: Female; Shielding: Unshielded; Number of Conductors: 4; Number of Ports: 1; Current Rating: 1A; Value: *; Supplier 1: Mouser; Stock 1: 7368; Pricing 1: 1=1.07000, 10=0.93900, 50=0.84700, 100=0.81000, 1000=0.58900, 10000=0.53400 (USD); Mount: Surface Mount; Case/Package: SMD/SMT; Color: Black; Contact Plating: Silver; Packaging: Tape and Reel; Connector Type: Jack; Orientation: Horizontal; Termination: Solder; ComponentLink1URL: https://datasheet.ciiva.com/7368/sj-4351x-smt-series-7368764.pdf?src-supplier=Digi-Key; ComponentLink1Description: https://datasheet.ciiva.com/7368/sj-4351x-smt-series-7368764.pdf?src-supplier=Digi-Key; ComponentLink2URL: https://datasheet.ciiva.com/7368/sj-4351x-smt-series-7368767.pdf?src-supplier=Digi-Key; ComponentLink2Description: https://datasheet.ciiva.com/7368/sj-4351x-smt-series-7368767.pdf?src-supplier=Digi-Key; ComponentLink3URL: http://datasheet.octopart.com/SJ-43515RS-SMT-TR-CUI-datasheet-103775270.pdf?src-supplier=CUI; ComponentLink3Description: http://datasheet.octopart.com/SJ-43515RS-SMT-TR-CUI-datasheet-103775270.pdf?src-supplier=CUI; ComponentLink4URL: http://datasheet.octopart.com/SJ-43515RS-SMT-TR-CUI-datasheet-136901581.pdf?src-supplier=CUI; ComponentLink4Description: http://datasheet.octopart.com/SJ-43515RS-SMT-TR-CUI-datasheet-136901581.pdf?src-supplier=CUI; ComponentLink5URL: http://datasheet.octopart.com/SJ-43515RS-SMT-TR-CUI-datasheet-103114024.pdf?src-supplier=Electro+Sonic; ComponentLink5Description: http://datasheet.octopart.com/SJ-43515RS-SMT-TR-CUI-datasheet-103114024.pdf?src-supplier=Electro+Sonic; ComponentLink6URL: http://datasheet.octopart.com/SJ-43515RS-SMT-TR-CUI-datasheet-13290545.pdf?src-supplier=Future+Electronics; ComponentLink6Description: http://datasheet.octopart.com/SJ-43515RS-SMT-TR-CUI-datasheet-13290545.pdf?src-supplier=Future+Electronics; ComponentLink7URL: http://datasheet.octopart.com/SJ-43515RS-SMT-TR-CUI-datasheet-102990244.pdf?src-supplier=Future+Electronics; ComponentLink7Description: http://datasheet.octopart.com/SJ-43515RS-SMT-TR-CUI-datasheet-102990244.pdf?src-supplier=Future+Electronics; ComponentLink8URL: http://datasheet.octopart.com/SJ-43515RS-SMT-TR-CUI-datasheet-103078434.pdf?src-supplier=Future+Electronics; ComponentLink8Description: http://datasheet.octopart.com/SJ-43515RS-SMT-TR-CUI-datasheet-103078434.pdf?src-supplier=Future+Electronics; Supplier Part Number 1: 490-SJ43515RS-SMT-TR
R68 R71 = RC0402FR-07220RL: RES SMD 220 OHM 1% 1/16W 0402; Manufacturer 1: Yageo; Voltage Rating: 50V; Temperature Coefficient: 100ppm/°C; Power Rating: 62.5mW; Max Power Dissipation: 63mW; Manufacturer Part Number 1: RC0402FR-07220RL; Supplier 1: Digi-Key; Stock 1: 2196434; Pricing 1: 1=0.10000, 10=0.01600, 100=0.00640, 1000=0.00289, 2500=0.00251, 5000=0.00207 (USD); RoHS: Yes; Case/Package: 0402; Number of Pins: 2; Case Code (Imperial): 0402; Case Code (Metric): 1005; Min Operating Temperature: -55°C; Max Operating Temperature: 155°C; Tolerance: 1%; Packaging: Tape and Reel; Package Quantity: 1; Termination: SMD/SMT; Resistance: 220R; Composition: Thick Film; Voltage Rating (DC): 50V; Military Standard: Not; Number of Terminations: 2; Features: Moisture Resistant; Length: 1mm; Height: 0.016inch; Width: 0.02inch; Depth: 0.5mm; REACH SVHC: No SVHC; Lead Free: Lead Free; ComponentLink1URL: https://datasheet.ciiva.com/11819/0900766b80c66297-11819466.pdf?src-supplier=RSComponents; ComponentLink1Description: https://datasheet.ciiva.com/11819/0900766b80c66297-11819466.pdf?src-supplier=RSComponents; ComponentLink2URL: https://datasheet.ciiva.com/2453/pyu-r-int-thick-7-2453460.pdf?src-supplier=Digi-Key; ComponentLink2Description: https://datasheet.ciiva.com/2453/pyu-r-int-thick-7-2453460.pdf?src-supplier=Digi-Key; ComponentLink3URL: https://datasheet.ciiva.com/2453/pyu-r-int-thick-7-2453461.pdf?src-supplier=Digi-Key; ComponentLink3Description: https://datasheet.ciiva.com/2453/pyu-r-int-thick-7-2453461.pdf?src-supplier=Digi-Key; ComponentLink4URL: https://datasheet.ciiva.com/2453/pyu-r-int-thick-7-2453462.pdf?src-supplier=Digi-Key; ComponentLink4Description: https://datasheet.ciiva.com/2453/pyu-r-int-thick-7-2453462.pdf?src-supplier=Digi-Key; ComponentLink5URL: https://datasheet.ciiva.com/16746/pyu-rc0402-51-rohs-l-6-r-16746831.pdf?src-supplier=Future+Electronics; ComponentLink5Description: https://datasheet.ciiva.com/16746/pyu-rc0402-51-rohs-l-6-r-16746831.pdf?src-supplier=Future+Electronics; Supplier 2: Mouser; Supplier Part Number 1: 311-220LRCT-ND; Supplier Part Number 2: 603-RC0402FR-07220RL
R69 R73 = RC0402FR-071K8L: RES SMD 1.8K OHM 1% 1/16W 0402; Manufacturer 1: Yageo; Resistance: 1.8kR; Temperature Coefficient: 100ppm/°C; Power Rating: 63mW; Voltage Rating: 50V; Manufacturer Part Number 1: RC0402FR-071K8L; Supplier 1: Digi-Key; Stock 1: 1041820; Pricing 1: 1=0.10000, 10=0.01600, 100=0.00640, 1000=0.00289, 2500=0.00251, 5000=0.00207 (USD); RoHS: Yes; Case/Package: 0402; Case Code (Imperial): 0402; Case Code (Metric): 1005; Min Operating Temperature: -55°C; Max Operating Temperature: 155°C; Tolerance: 1%; Packaging: Tape and Reel; Composition: Thick Film; Package Quantity: 1; Termination: SMD/SMT; Number of Terminations: 2; Max Power Dissipation: 63mW; Military Standard: Not; Features: Moisture Resistant; Working Voltage: 50V; Length: 1mm; Height: 0.016inch; Width: 0.02inch; Depth: 0.5mm; Lead Free: Lead Free; REACH SVHC: Unknown; ComponentLink1URL: https://datasheet.ciiva.com/11819/0900766b80c66297-11819472.pdf?src-supplier=RSComponents; ComponentLink1Description: https://datasheet.ciiva.com/11819/0900766b80c66297-11819472.pdf?src-supplier=RSComponents; ComponentLink2URL: https://datasheet.ciiva.com/2453/pyu-r-int-thick-7-2453530.pdf?src-supplier=Digi-Key; ComponentLink2Description: https://datasheet.ciiva.com/2453/pyu-r-int-thick-7-2453530.pdf?src-supplier=Digi-Key; ComponentLink3URL: https://datasheet.ciiva.com/7849/1018594-7849868.pdf?src-supplier=Element14; ComponentLink3Description: https://datasheet.ciiva.com/7849/1018594-7849868.pdf?src-supplier=Element14; ComponentLink4URL: https://datasheet.ciiva.com/16744/pyu-rc0402-51-rohs-l-6-r-16744223.pdf?src-supplier=Future+Electronics; ComponentLink4Description: https://datasheet.ciiva.com/16744/pyu-rc0402-51-rohs-l-6-r-16744223.pdf?src-supplier=Future+Electronics; ComponentLink5URL: https://datasheet.ciiva.com/7849/1018594-7849867.pdf?src-supplier=Element14; ComponentLink5Description: https://datasheet.ciiva.com/7849/1018594-7849867.pdf?src-supplier=Element14; ComponentLink6URL: https://datasheet.ciiva.com/12667/pyu-rc0402-51-rohs-l-6-r-12667431.pdf?src-supplier=Mouser; ComponentLink6Description: https://datasheet.ciiva.com/12667/pyu-rc0402-51-rohs-l-6-r-12667431.pdf?src-supplier=Mouser; ComponentLink7URL: https://datasheet.ciiva.com/2453/pyu-r-int-thick-7-2453529.pdf?src-supplier=Digi-Key; ComponentLink7Description: https://datasheet.ciiva.com/2453/pyu-r-int-thick-7-2453529.pdf?src-supplier=Digi-Key; ComponentLink8URL: https://datasheet.ciiva.com/2453/pyu-r-int-thick-7-2453531.pdf?src-supplier=Digi-Key; ComponentLink8Description: https://datasheet.ciiva.com/2453/pyu-r-int-thick-7-2453531.pdf?src-supplier=Digi-Key; Supplier 2: Mouser; Supplier Part Number 2: 603-RC0402FR-071K8L; Supplier Part Number 1: 311-1.80KLRCT-ND
R70 R72 = RC0402FR-07100RL: RES SMD 100 OHM 1% 1/16W 0402; Manufacturer 1: Yageo; Temperature Coefficient: 100ppm/°C; Power Rating: 62.5mW; Voltage Rating: 50V; Manufacturer Part Number 1: RC0402FR-07100RL; Supplier 1: Digi-Key; Stock 1: 45349485; Pricing 1: 1=0.10000, 10=0.01600, 100=0.00640, 1000=0.00289, 2500=0.00251, 5000=0.00207 (USD); RoHS: Yes; Case/Package: 0402; Number of Pins: 2; Case Code (Imperial): 0402; Case Code (Metric): 1005; Min Operating Temperature: -55°C; Max Operating Temperature: 155°C; Tolerance: 1%; Resistance: 100R; Packaging: Tape and Reel; Composition: Thick Film; Voltage Rating (DC): 50V; Military Standard: Not; Termination: SMD/SMT; Length: 1mm; Height: 0.32mm; Width: 0.5mm; Depth: 0.5mm; REACH SVHC: No SVHC; Lead Free: Lead Free; ComponentLink1URL: https://datasheet.ciiva.com/7849/1784430-7849810.pdf?src-supplier=Element14; ComponentLink1Description: https://datasheet.ciiva.com/7849/1784430-7849810.pdf?src-supplier=Element14; ComponentLink2URL: https://datasheet.ciiva.com/11808/0900766b80c66297-11808765.pdf?src-supplier=RSComponents; ComponentLink2Description: https://datasheet.ciiva.com/11808/0900766b80c66297-11808765.pdf?src-supplier=RSComponents; ComponentLink3URL: https://datasheet.ciiva.com/12667/pyu-rc0402-51-rohs-l-6-r-12667957.pdf?src-supplier=Mouser; ComponentLink3Description: https://datasheet.ciiva.com/12667/pyu-rc0402-51-rohs-l-6-r-12667957.pdf?src-supplier=Mouser; ComponentLink4URL: https://datasheet.ciiva.com/22747/1018594-22747511.pdf?src-supplier=Element14; ComponentLink4Description: https://datasheet.ciiva.com/22747/1018594-22747511.pdf?src-supplier=Element14; ComponentLink5URL: https://datasheet.ciiva.com/28367/1018594-28367226.pdf?src-supplier=Element14; ComponentLink5Description: https://datasheet.ciiva.com/28367/1018594-28367226.pdf?src-supplier=Element14; ComponentLink6URL: https://datasheet.ciiva.com/16740/pyu-rc0402-51-rohs-l-6-r-16740566.pdf?src-supplier=Future+Electronics; ComponentLink6Description: https://datasheet.ciiva.com/16740/pyu-rc0402-51-rohs-l-6-r-16740566.pdf?src-supplier=Future+Electronics; ComponentLink7URL: https://datasheet.ciiva.com/15189/getdatasheetpartid-329466-15189335.pdf?src-supplier=Verical; ComponentLink7Description: https://datasheet.ciiva.com/15189/getdatasheetpartid-329466-15189335.pdf?src-supplier=Verical; Supplier 2: Newark; Supplier 3: Mouser; Supplier Part Number 1: 311-100LRCT-ND; Supplier Part Number 2: 45Y6897; Supplier Part Number 3: 603-RC0402FR-07100RL
U9 = NC7WZ16P6X: IC BUF NON-INVERT 5.5V SC70-6 Buffer, Non-Inverting 2 Element 1 Bit per Element Push-Pull Output SC-88 (SC-70-6); Manufacturer 1: ON Semiconductor / Fairchild; Min Supply Voltage: 1.65V; Logic Function: Buffer,Inverting; Low Level Output Current: 32mA; High Level Output Current: -32mA; Propagation Delay: 3.8ns; Number of Elements: 2; Number of Bits per Element: 1; Max Power Dissipation: 180mW; Turn-On Delay Time: 10.6ns; Quiescent Current: 1uA; Supplier 1: Digi-Key; Manufacturer Part Number 1: NC7WZ16P6X; Stock 1: 89814; Pricing 1: 1=0.44000, 10=0.32600, 100=0.18480, 500=0.12238, 1000=0.09382 (USD); RoHS: Yes; Mount: Surface Mount; Case/Package: SC; Number of Pins: 6; Weight: 0.028g; Contact Plating: Tin,Matte; Min Operating Temperature: -40°C; Max Operating Temperature: 125°C; Max Supply Voltage: 5.5V; Packaging: Tape and Reel; Polarity: Non-Inverting; Package Quantity: 3000; Number of Input Lines: 2; Number of Output Lines: 2; Number of Channels: 2; Number of Bits: 2; Number of Inputs: 2; Number of Outputs: 2; Number of Circuits: 2; Termination: SMD/SMT; Length: 2mm; Height: 1mm; Width: 1.25mm; Radiation Hardening: No; Lead Free: Lead Free; REACH SVHC: No SVHC; ComponentLink1URL: https://datasheet.ciiva.com/5701/1725615-5701889.pdf?src-supplier=Farnell; ComponentLink1Description: https://datasheet.ciiva.com/5701/1725615-5701889.pdf?src-supplier=Farnell; ComponentLink2URL: https://datasheet.ciiva.com/15094/getdatasheetpartid-92041-15094657.pdf?src-supplier=Verical; ComponentLink2Description: https://datasheet.ciiva.com/15094/getdatasheetpartid-92041-15094657.pdf?src-supplier=Verical; ComponentLink3URL: https://datasheet.ciiva.com/27051/1028128-27051265.pdf?src-supplier=Jameco; ComponentLink3Description: https://datasheet.ciiva.com/27051/1028128-27051265.pdf?src-supplier=Jameco; ComponentLink4URL: https://datasheet.ciiva.com/8260/nc7wz16-8260101.pdf?src-supplier=Avnet; ComponentLink4Description: https://datasheet.ciiva.com/8260/nc7wz16-8260101.pdf?src-supplier=Avnet; ComponentLink5URL: https://datasheet.ciiva.com/17332/nc7wz16-17332853.pdf?src-supplier=Future+Electronics; ComponentLink5Description: https://datasheet.ciiva.com/17332/nc7wz16-17332853.pdf?src-supplier=Future+Electronics; ComponentLink6URL: https://datasheet.ciiva.com/8260/nc7wz16-8260105.pdf?src-supplier=Avnet; ComponentLink6Description: https://datasheet.ciiva.com/8260/nc7wz16-8260105.pdf?src-supplier=Avnet; ComponentLink7URL: https://datasheet.ciiva.com/26096/nc7wz16-26096508.pdf?src-supplier=Avnet+Europe; ComponentLink7Description: https://datasheet.ciiva.com/26096/nc7wz16-26096508.pdf?src-supplier=Avnet+Europe; ComponentLink8URL: https://datasheet.ciiva.com/1832/nc7wz16-1832237.pdf?src-supplier=Digi-Key; ComponentLink8Description: https://datasheet.ciiva.com/1832/nc7wz16-1832237.pdf?src-supplier=Digi-Key; ComponentLink9URL: https://datasheet.ciiva.com/7971/1725615-7971037.pdf?src-supplier=Element14; ComponentLink9Description: https://datasheet.ciiva.com/7971/1725615-7971037.pdf?src-supplier=Element14; ComponentLink10URL: https://datasheet.ciiva.com/1832/nc7wz16-1832238.pdf?src-supplier=Digi-Key; ComponentLink10Description: https://datasheet.ciiva.com/1832/nc7wz16-1832238.pdf?src-supplier=Digi-Key; ComponentLink11URL: https://datasheet.ciiva.com/1832/nc7wz16-1832239.pdf?src-supplier=Digi-Key; ComponentLink11Description: https://datasheet.ciiva.com/1832/nc7wz16-1832239.pdf?src-supplier=Digi-Key; Supplier Part Number 1: NC7WZ16P6XCT-ND